# Altium schematic sheet keyboard.SchDoc
size A0
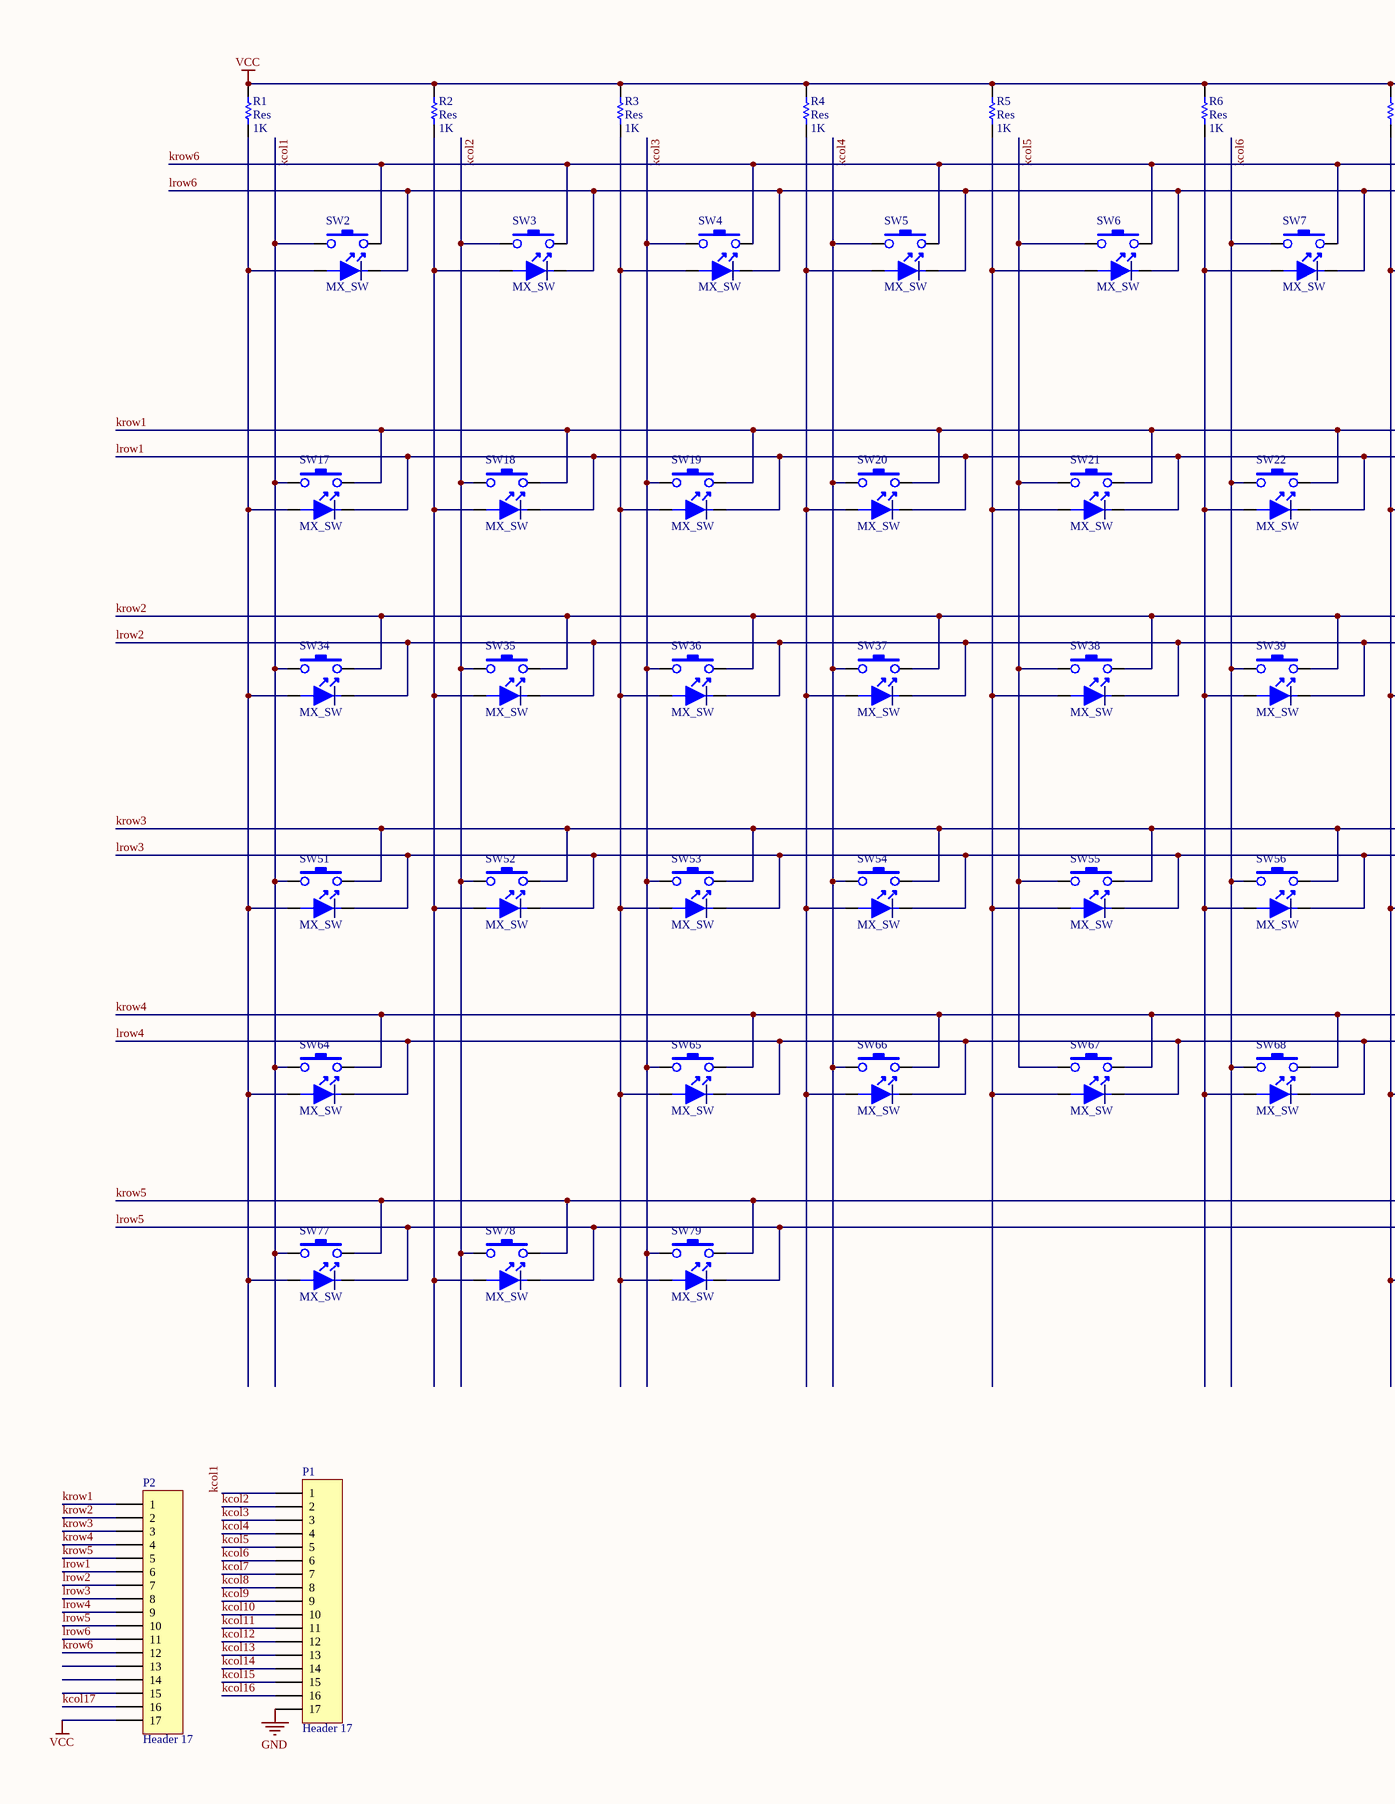
[diagram p0: keyboard.SchDoc, left]
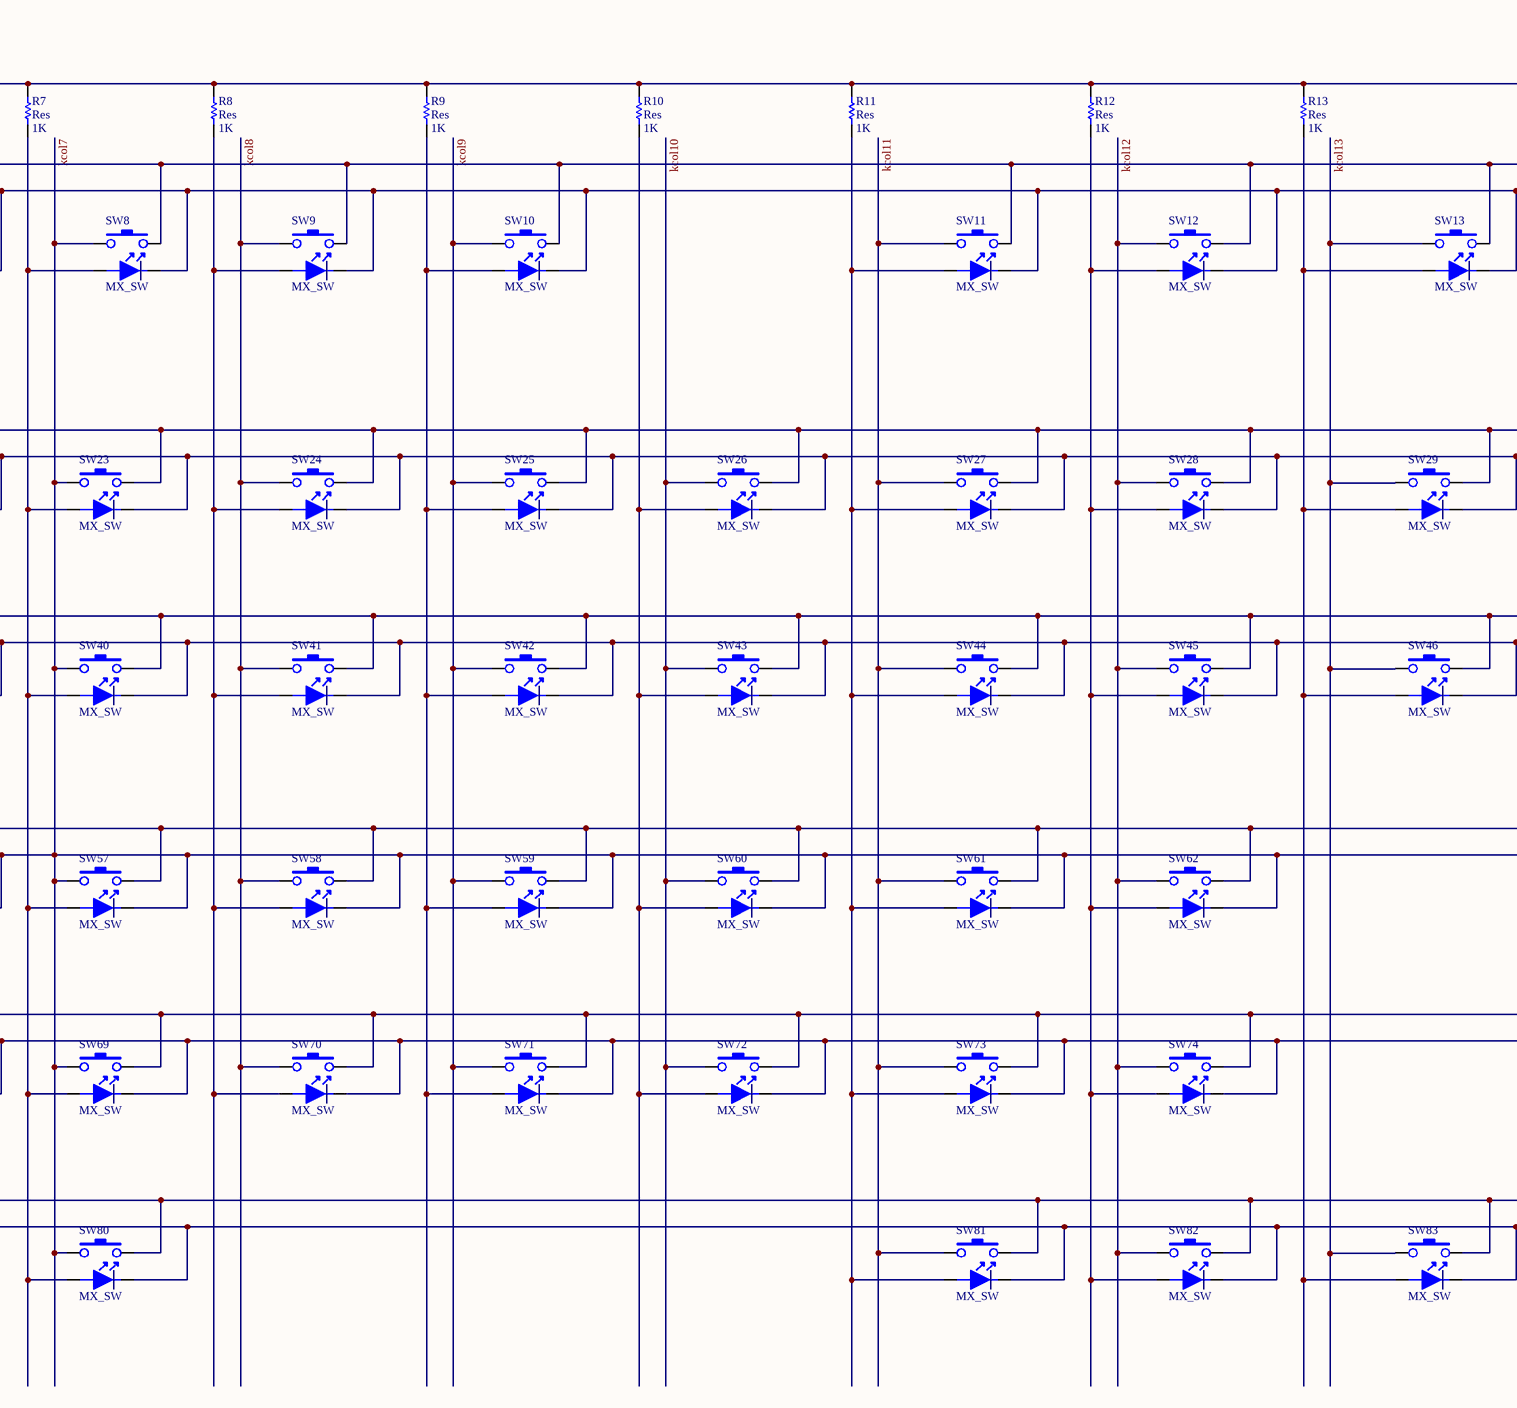
[diagram p1: keyboard.SchDoc, middle]
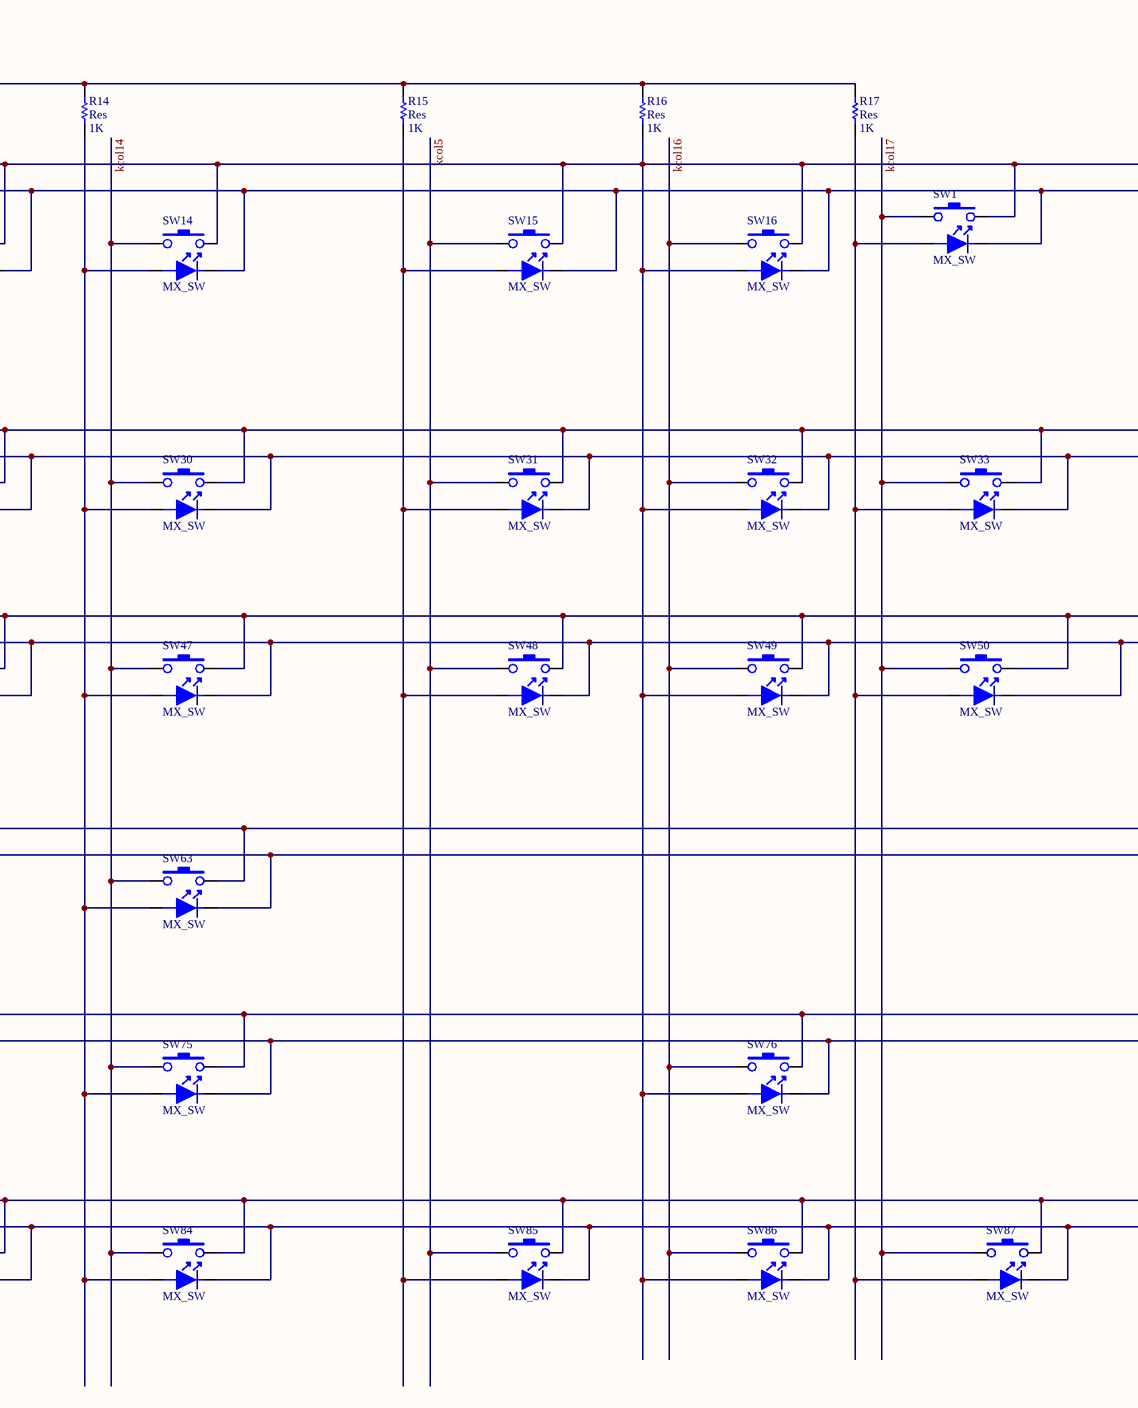
[diagram p2: keyboard.SchDoc, right]

## Parts
P1  Header 17  [HDR1X17]
P2  Header 17  [HDR1X17]
R1  Res  value 1K  [R2012]
R2  Res  value 1K  [R2012]
R3  Res  value 1K  [R2012]
R4  Res  value 1K  [R2012]
R5  Res  value 1K  [R2012]
R6  Res  value 1K  [R2012]
R7  Res  value 1K  [R2012]
R8  Res  value 1K  [R2012]
R9  Res  value 1K  [R2012]
R10  Res  value 1K  [R2012]
R11  Res  value 1K  [R2012]
R12  Res  value 1K  [R2012]
R13  Res  value 1K  [R2012]
R14  Res  value 1K  [R2012]
R15  Res  value 1K  [R2012]
R16  Res  value 1K  [R2012]
R17  Res  value 1K  [R2012]
SW1  MX_SW  [MX_SW-2]
SW2  MX_SW  [MX_SW-2]
SW3  MX_SW  [MX_SW-2]
SW4  MX_SW  [MX_SW-2]
SW5  MX_SW  [MX_SW-2]
SW6  MX_SW  [MX_SW-2]
SW7  MX_SW  [MX_SW-2]
SW8  MX_SW  [MX_SW-2]
SW9  MX_SW  [MX_SW-2]
SW10  MX_SW  [MX_SW-2]
SW11  MX_SW  [MX_SW-2]
SW12  MX_SW  [MX_SW-2]
SW13  MX_SW  [MX_SW-2]
SW14  MX_SW  [MX_SW-2]
SW15  MX_SW  [MX_SW-2]
SW16  MX_SW  [MX_SW-2]
SW17  MX_SW  [MX_SW-2]
SW18  MX_SW  [MX_SW-2]
SW19  MX_SW  [MX_SW-2]
SW20  MX_SW  [MX_SW-2]
SW21  MX_SW  [MX_SW-2]
SW22  MX_SW  [MX_SW-2]
SW23  MX_SW  [MX_SW-2]
SW24  MX_SW  [MX_SW-2]
SW25  MX_SW  [MX_SW-2]
SW26  MX_SW  [MX_SW-2]
SW27  MX_SW  [MX_SW-2]
SW28  MX_SW  [MX_SW-2]
SW29  MX_SW  [MX_SW-2]
SW30  MX_SW  [MX_SW-2]
SW31  MX_SW  [MX_SW-2]
SW32  MX_SW  [MX_SW-2]
SW33  MX_SW  [MX_SW-2]
SW34  MX_SW  [MX_SW-2]
SW35  MX_SW  [MX_SW-2]
SW36  MX_SW  [MX_SW-2]
SW37  MX_SW  [MX_SW-2]
SW38  MX_SW  [MX_SW-2]
SW39  MX_SW  [MX_SW-2]
SW40  MX_SW  [MX_SW-2]
SW41  MX_SW  [MX_SW-2]
SW42  MX_SW  [MX_SW-2]
SW43  MX_SW  [MX_SW-2]
SW44  MX_SW  [MX_SW-2]
SW45  MX_SW  [MX_SW-2]
SW46  MX_SW  [MX_SW-2]
SW47  MX_SW  [MX_SW-2]
SW48  MX_SW  [MX_SW-2]
SW49  MX_SW  [MX_SW-2]
SW50  MX_SW  [MX_SW-2]
SW51  MX_SW  [MX_SW-2]
SW52  MX_SW  [MX_SW-2]
SW53  MX_SW  [MX_SW-2]
SW54  MX_SW  [MX_SW-2]
SW55  MX_SW  [MX_SW-2]
SW56  MX_SW  [MX_SW-2]
SW57  MX_SW  [MX_SW-2]
SW58  MX_SW  [MX_SW-2]
SW59  MX_SW  [MX_SW-2]
SW60  MX_SW  [MX_SW-2]
SW61  MX_SW  [MX_SW-2]
SW62  MX_SW  [MX_SW-2]
SW63  MX_SW  [MX_SW-2]
SW64  MX_SW  [MX_SW-2]
SW65  MX_SW  [MX_SW-2]
SW66  MX_SW  [MX_SW-2]
SW67  MX_SW  [MX_SW-2]
SW68  MX_SW  [MX_SW-2]
SW69  MX_SW  [MX_SW-2]
SW70  MX_SW  [MX_SW-2]
SW71  MX_SW  [MX_SW-2]
SW72  MX_SW  [MX_SW-2]
SW73  MX_SW  [MX_SW-2]
SW74  MX_SW  [MX_SW-2]
SW75  MX_SW  [MX_SW-2]
SW76  MX_SW  [MX_SW-2]
SW77  MX_SW  [MX_SW-2]
SW78  MX_SW  [MX_SW-2]
SW79  MX_SW  [MX_SW-2]
SW80  MX_SW  [MX_SW-2]
SW81  MX_SW  [MX_SW-2]
SW82  MX_SW  [MX_SW-2]
SW83  MX_SW  [MX_SW-2]
SW84  MX_SW  [MX_SW-2]
SW85  MX_SW  [MX_SW-2]
SW86  MX_SW  [MX_SW-2]
SW87  MX_SW  [MX_SW-2]

## Nets
GND: P1.17
VCC: P2.17 R1.2 R2.2 R3.2 R4.2 R5.2 R6.2 R7.2 R8.2 R9.2 R10.2 R11.2 R12.2 R13.2 R14.2 R15.2 R16.2 R17.2
kcol1: P1.1 SW2.1 SW17.1 SW34.1 SW51.1 SW64.1 SW77.1
kcol2: P1.2 SW3.1 SW18.1 SW35.1 SW52.1 SW78.1
kcol3: P1.3 SW4.1 SW19.1 SW36.1 SW53.1 SW65.1 SW79.1
kcol4: P1.4 SW5.1 SW20.1 SW37.1 SW54.1 SW66.1
kcol5: P1.5 SW6.1 SW15.1 SW21.1 SW31.1 SW38.1 SW48.1 SW55.1 SW67.1 SW85.1
kcol6: P1.6 SW7.1 SW22.1 SW39.1 SW56.1 SW68.1
kcol7: P1.7 P2.8 SW8.1 SW23.1 SW40.1 SW51.4 SW52.4 SW53.4 SW54.4 SW55.4 SW56.4 SW57.1 SW57.4 SW58.4 SW59.4 SW60.4 SW61.4 SW62.4 SW63.4 SW69.1 SW80.1  [also labelled lrow3]
kcol8: P1.8 SW9.1 SW24.1 SW41.1 SW58.1 SW70.1
kcol9: P1.9 SW10.1 SW25.1 SW42.1 SW59.1 SW71.1
kcol10: P1.10 SW26.1 SW43.1 SW60.1 SW72.1
kcol11: P1.11 SW11.1 SW27.1 SW44.1 SW61.1 SW73.1 SW81.1
kcol12: P1.12 SW12.1 SW28.1 SW45.1 SW62.1 SW74.1 SW82.1
kcol13: P1.13 SW13.1 SW29.1 SW46.1 SW83.1
kcol14: P1.14 SW14.1 SW30.1 SW47.1 SW63.1 SW75.1 SW84.1
kcol15: P1.15
kcol16: P1.16 SW16.1 SW32.1 SW49.1 SW76.1 SW86.1
kcol17: P2.16 SW1.1 SW33.1 SW50.1 SW87.1
krow1: P2.1 SW17.2 SW18.2 SW19.2 SW20.2 SW21.2 SW22.2 SW23.2 SW24.2 SW25.2 SW26.2 SW27.2 SW28.2 SW29.2 SW30.2 SW31.2 SW32.2 SW33.2
krow2: P2.2 SW34.2 SW35.2 SW36.2 SW37.2 SW38.2 SW39.2 SW40.2 SW41.2 SW42.2 SW43.2 SW44.2 SW45.2 SW46.2 SW47.2 SW48.2 SW49.2 SW50.2
krow3: P2.3 SW51.2 SW52.2 SW53.2 SW54.2 SW55.2 SW56.2 SW57.2 SW58.2 SW59.2 SW60.2 SW61.2 SW62.2 SW63.2
krow4: P2.4 SW64.2 SW65.2 SW66.2 SW67.2 SW68.2 SW69.2 SW70.2 SW71.2 SW72.2 SW73.2 SW74.2 SW75.2 SW76.2
krow5: P2.5 SW77.2 SW78.2 SW79.2 SW80.2 SW81.2 SW82.2 SW83.2 SW84.2 SW85.2 SW86.2 SW87.2
krow6: P2.12 R16.1 SW1.2 SW2.2 SW3.2 SW4.2 SW5.2 SW6.2 SW7.2 SW8.2 SW9.2 SW10.2 SW11.2 SW12.2 SW13.2 SW14.2 SW15.2 SW16.2 SW16.3 SW32.3 SW49.3 SW76.3 SW86.3
lrow1: P2.6 SW17.4 SW18.4 SW19.4 SW20.4 SW21.4 SW22.4 SW23.4 SW24.4 SW25.4 SW26.4 SW27.4 SW28.4 SW29.4 SW30.4 SW31.4 SW32.4 SW33.4
lrow2: P2.7 SW34.4 SW35.4 SW36.4 SW37.4 SW38.4 SW39.4 SW40.4 SW41.4 SW42.4 SW43.4 SW44.4 SW45.4 SW46.4 SW47.4 SW48.4 SW49.4 SW50.4
lrow4: P2.9 SW64.4 SW65.4 SW66.4 SW67.4 SW68.4 SW69.4 SW70.4 SW71.4 SW72.4 SW73.4 SW74.4 SW75.4 SW76.4
lrow5: P2.10 SW77.4 SW78.4 SW79.4 SW80.4 SW81.4 SW82.4 SW83.4 SW84.4 SW85.4 SW86.4 SW87.4
lrow6: P2.11 SW1.4 SW2.4 SW3.4 SW4.4 SW5.4 SW6.4 SW7.4 SW8.4 SW9.4 SW10.4 SW11.4 SW12.4 SW13.4 SW14.4 SW15.4 SW16.4
NetR1_1: R1.1 SW2.3 SW17.3 SW34.3 SW51.3 SW64.3 SW77.3
NetR2_1: R2.1 SW3.3 SW18.3 SW35.3 SW52.3 SW78.3
NetR3_1: R3.1 SW4.3 SW19.3 SW36.3 SW53.3 SW65.3 SW79.3
NetR4_1: R4.1 SW5.3 SW20.3 SW37.3 SW54.3 SW66.3
NetR5_1: R5.1 SW6.3 SW21.3 SW38.3 SW55.3 SW67.3
NetR6_1: R6.1 SW7.3 SW22.3 SW39.3 SW56.3 SW68.3
NetR7_1: R7.1 SW8.3 SW23.3 SW40.3 SW57.3 SW69.3 SW80.3
NetR8_1: R8.1 SW9.3 SW24.3 SW41.3 SW58.3 SW70.3
NetR9_1: R9.1 SW10.3 SW25.3 SW42.3 SW59.3 SW71.3
NetR10_1: R10.1 SW26.3 SW43.3 SW60.3 SW72.3
NetR11_1: R11.1 SW11.3 SW27.3 SW44.3 SW61.3 SW73.3 SW81.3
NetR12_1: R12.1 SW12.3 SW28.3 SW45.3 SW62.3 SW74.3 SW82.3
NetR13_1: R13.1 SW13.3 SW29.3 SW46.3 SW83.3
NetR14_1: R14.1 SW14.3 SW30.3 SW47.3 SW63.3 SW75.3 SW84.3
NetR15_1: R15.1 SW15.3 SW31.3 SW48.3 SW85.3
NetR17_1: R17.1 SW1.3 SW33.3 SW50.3 SW87.3

Not connected (* = marked no-connect by the designer): P2 13 14 15

## Library data of the parts
P1 P2 = Header 17: Header, 17-Pin; LatestRevisionDate: 17-Jul-2002; LatestRevisionNote: Re-released for DXP Platform.; Publisher: Altium Limited
R1-R17 = Res: 贴片电阻; Published: 8-Jun-2000; LatestRevisionDate: 17-Jul-2002; LatestRevisionNote: Re-released for DXP Platform.; PackageReference: AXIAL-0.3; Publisher: Altium Limited
SW1-SW87 = MX_SW-2: without Fixation pins  1-Pole w/LED